# Altium project ToFAvoid.PrjPcb
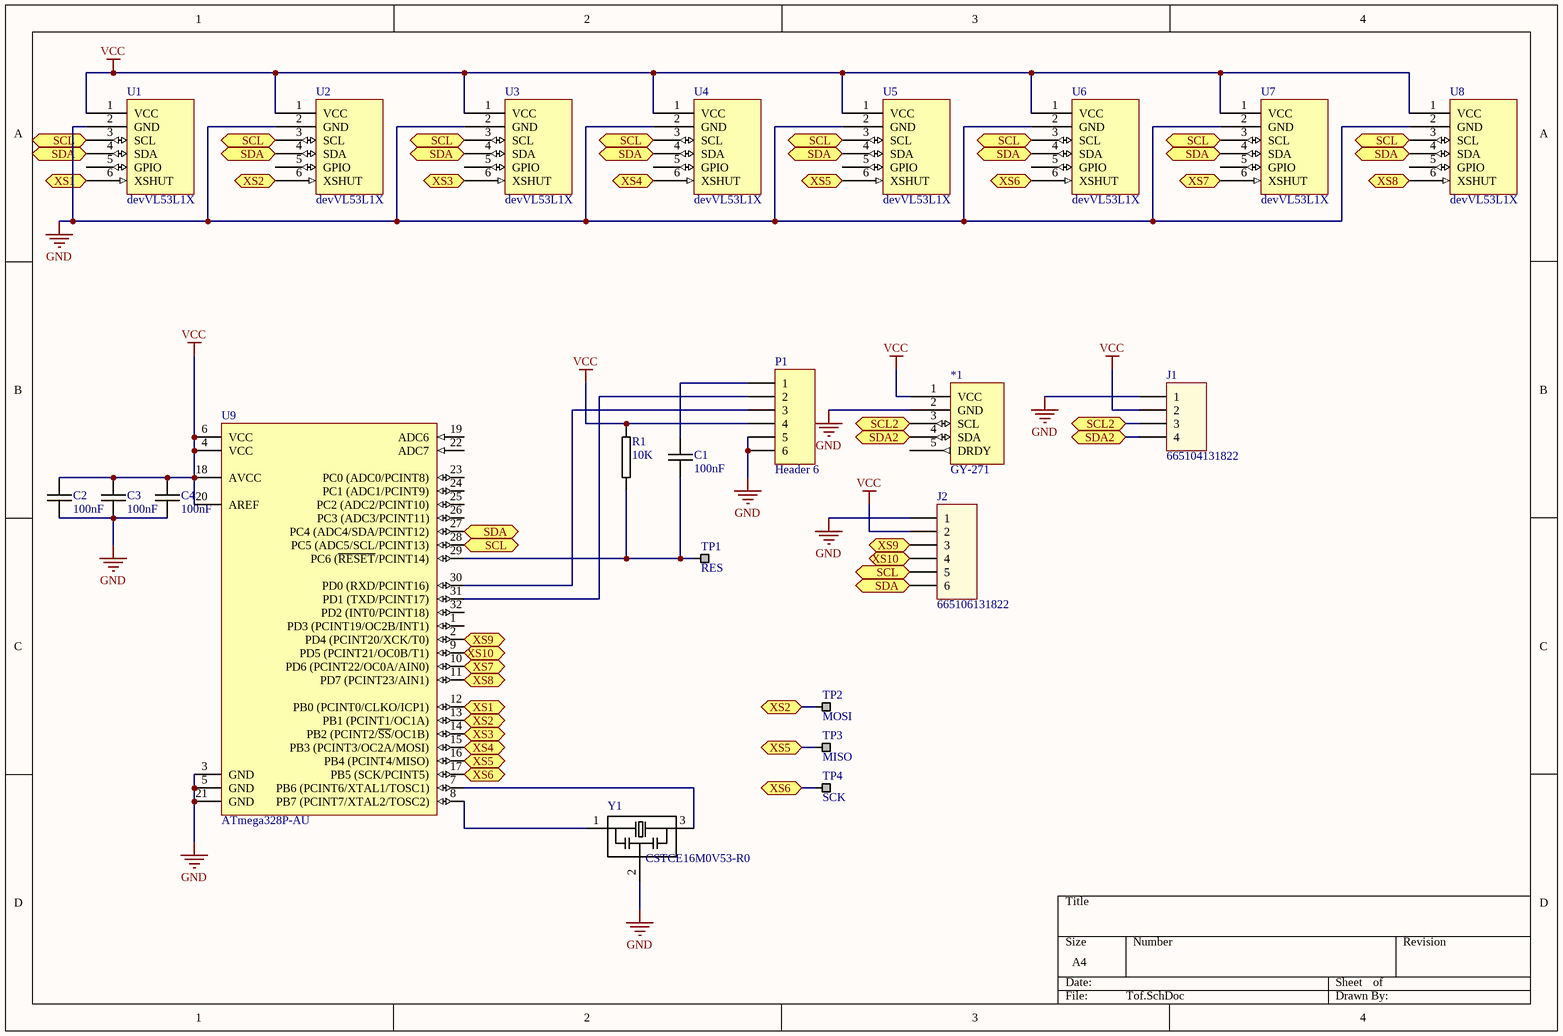
[diagram p0: Tof.SchDoc]
1 sheet, 23 parts. Net scope: flat (ports and power ports of the same name join across sheets).
Board file: ToF.PcbDoc

## Sheet Tof.SchDoc
size A4

### Parts
*1  GY-271  [GY-271]
C1  100nF  [0603C-GENERIC]
C2  100nF  [0603C-GENERIC]
C3  100nF  [0603C-GENERIC]
C4  100nF  [0603C-GENERIC]
J1  665104131822  [665104131822]
J2  665106131822  [665106131822]
P1  Header 6  [HDR1X6]
R1  10K  [0603R-10K]
TP1  RES  [TESTPIN]
TP2  MOSI  [TESTPIN]
TP3  MISO  [TESTPIN]
TP4  SCK  [TESTPIN]
U1  devVL53L1X  [TOF4]
U2  devVL53L1X  [TOF4]
U3  devVL53L1X  [TOF4]
U4  devVL53L1X  [TOF4]
U5  devVL53L1X  [TOF4]
U6  devVL53L1X  [TOF4]
U7  devVL53L1X  [TOF4]
U8  devVL53L1X  [TOF4]
U9  ATmega328P-AU  [32A_N]
Y1  CSTCE16M0V53-R0  [OSC_CSTCE16M0V53-R0]

### Ports
SCL, SCL2, SDA, SDA2, XS1, XS2, XS3, XS4, XS5, XS6, XS7, XS8, XS9, XS10

### Nets
GND: *1.2(GND) C2.2 C3.2 C4.2 J1.1 J2.1 P1.5 P1.6 U1.2(GND) U2.2(GND) U3.2(GND) U4.2(GND) U5.2(GND) U6.2(GND) U7.2(GND) U8.2(GND) U9.3(GND) U9.5(GND) U9.21(GND) Y1.2
VCC: *1.1(VCC) C2.1 C3.1 C4.1 J1.2 J2.2 P1.4 R1.2 U1.1(VCC) U2.1(VCC) U3.1(VCC) U4.1(VCC) U5.1(VCC) U6.1(VCC) U7.1(VCC) U8.1(VCC) U9.4(VCC) U9.6(VCC) U9.18(AVCC) U9.20(AREF)
Net*1_3: *1.3(SCL) J1.3 ; port SCL2
Net*1_4: *1.4(SDA) J1.4 ; port SDA2
NetC1_1: C1.1 P1.1
NetC1_2: C1.2 R1.1 TP1.1 U9.29(PC6_(~{RESET}/PCINT14))
NetJ2_3: J2.3 U9.2(PD4_(PCINT20/XCK/T0)) ; port XS9
NetJ2_4: J2.4 U9.9(PD5_(PCINT21/OC0B/T1)) ; port XS10
NetJ2_5: J2.5 U1.3(SCL) U2.3(SCL) U3.3(SCL) U4.3(SCL) U5.3(SCL) U6.3(SCL) U7.3(SCL) U8.3(SCL) U9.28(PC5_(ADC5/SCL/PCINT13)) ; port SCL
NetJ2_6: J2.6 U1.4(SDA) U2.4(SDA) U3.4(SDA) U4.4(SDA) U5.4(SDA) U6.4(SDA) U7.4(SDA) U8.4(SDA) U9.27(PC4_(ADC4/SDA/PCINT12)) ; port SDA
NetP1_2: P1.2 U9.31(PD1_(TXD/PCINT17))
NetP1_3: P1.3 U9.30(PD0_(RXD/PCINT16))
NetTP2_1: TP2.1 U2.6(XSHUT) U9.13(PB1_(PCINT1/OC1A)) ; port XS2
NetTP3_1: TP3.1 U5.6(XSHUT) U9.16(PB4_(PCINT4/MISO)) ; port XS5
NetTP4_1: TP4.1 U6.6(XSHUT) U9.17(PB5_(SCK/PCINT5)) ; port XS6
NetU1_6: U1.6(XSHUT) U9.12(PB0_(PCINT0/CLKO/ICP1)) ; port XS1
NetU3_6: U3.6(XSHUT) U9.14(PB2_(PCINT2/~{SS}/OC1B)) ; port XS3
NetU4_6: U4.6(XSHUT) U9.15(PB3_(PCINT3/OC2A/MOSI)) ; port XS4
NetU7_6: U7.6(XSHUT) U9.10(PD6_(PCINT22/OC0A/AIN0)) ; port XS7
NetU8_6: U8.6(XSHUT) U9.11(PD7_(PCINT23/AIN1)) ; port XS8
NetU9_7: U9.7(PB6_(PCINT6/XTAL1/TOSC1)) Y1.3
NetU9_8: U9.8(PB7_(PCINT7/XTAL2/TOSC2)) Y1.1

Not connected (* = marked no-connect by the designer): *1 5(DRDY); U1 5(GPIO); U2 5(GPIO); U3 5(GPIO); U4 5(GPIO); U5 5(GPIO); U6 5(GPIO); U7 5(GPIO); U8 5(GPIO); U9 1(PD3_(PCINT19/OC2B/INT1)) 19(ADC6) 22(ADC7) 23(PC0_(ADC0/PCINT8)) 24(PC1_(ADC1/PCINT9)) 25(PC2_(ADC2/PCINT10)) 26(PC3_(ADC3/PCINT11)) 32(PD2_(INT0/PCINT18))

### Library data of the parts
C1-C4 = 0603C-100NF-25V-X7R-TDK: CAPACITOR 0603 CERAMIC; Manufacturer Part Number: C1608X7R1E104K; Manufacturer: TDK Corporation; Reel: C12; Supplier 1: Digi-Key; Supplier Part Number 1: 445-1316-2-ND
J1 = 665104131822: WR-WTB 1.00 mm SMT Male Horizontal Shrouded, 4p; Pitch: 1 mm; Pin Number: 4; ComponentLink1Description: Manufacturer; ComponentLink1URL: http://www.we-online.de; ComponentLink2Description: Datasheet; ComponentLink2URL: http://katalog.we-online.de/em/datasheet/6651xx131822.pdf; Part Number: 665104131822; Published Date: June 2017; Publisher: Wurth Elektronik
J2 = 665106131822: WR-WTB 1.00 mm SMT Male Horizontal Shrouded, 6p; Pitch: 1 mm; Pin Number: 6; ComponentLink1Description: Manufacturer; ComponentLink1URL: http://www.we-online.de; ComponentLink2Description: Datasheet; ComponentLink2URL: http://katalog.we-online.de/em/datasheet/6651xx131822.pdf; Part Number: 665106131822; Published Date: June 2017; Publisher: Wurth Elektronik
P1 = Header 6: Header, 6-Pin; LatestRevisionDate: 17-Jul-2002; LatestRevisionNote: Re-released for DXP Platform.; Publisher: Altium Limited
R1 = 0603R-10K: GENERIC RESISTOR 0603; Manufacturer: Stackpole Electronics Inc; Manufacturer Part Number: RMCF 1/16 10K 1% R; Tolerance: ±1%; Power (Watts): 0.1W, 1/10W; Temperature Coefficient: ±100ppm/°C; Resistance In Ohms: 10.0K; Reel: R21; Category: Resistors; Supplier Part Number: RMCF1/1610KFRDKR-ND; Lead Style: Surface Mount (SMD - SMT); RoHS: RoHS Compliant; Packaging: Digi-Reel®; Case: 0603 (1608 metric); Composition: Thick Film; Supplier: Digi-Key; Supplier 1: Digi-Key; Supplier Part Number 1: RMCF0603FT10K0DKR-ND
TP1-TP4 = TESTPIN: TESTPIN SINGLE PIN HEADER; Manufacturer 1: Sharon Long Industries; Manufacturer Part Number 1: Cut-it-yourself; Reel: TH; Supplier 1: Sharon Long Industries; Supplier 1 Part number: Cut-It-Yourself
U1-U8 = devVL53L1X: ToF sensor
U9 = ATmega328P-AU: 8-bit AVR Microcontroller, 32KB Flash, 1KB EEPROM, 2KB SRAM, 32-pin TQFP, Industrial Grade (-40°C to 85°C); DatasheetVersion: revD, May-2011; PackageVersion: revC, Oct-2010; PackageReference: 32A; PackageDescription: 32-Lead, 7x7x1.0 mm Body, 0.8mm Lead Pitch, Thin Profile Plastic Quad Flat Package (TQFP); Code_JEDEC: MS-026-ABA; ComponentLink1Description: Manufacturer URL; ComponentLink1URL: http://www.atmel.com/; ComponentLink2Description: ATmega48A/48PA/88A/88PA/168A/168PA/328/328P Datasheet; ComponentLink2URL: http://www.atmel.com/dyn/resources/prod_documents/doc8271.pdf; ComponentLink3Description: ATmega48A/48PA/88A/88PA/168A/168PA/328/328P Summary; ComponentLink3URL: http://www.atmel.com/dyn/resources/prod_documents/8271S.pdf
Y1 = CSTCE16M0V53-R0: Ceramic Resonator 16MHz ??0.5% _Tol_ ??0.3% _Stability_ 15pF 40Ohm 3-Pin CSMD T/R; MF: Murata; SnapEDA_Link: https://www.snapeda.com/parts/CSTCE16M0V53-R0/Murata%20Electronics%20North%20America/view-part/?ref=snap; Availability: Unavailable; MP: CSTCE16M0V53-R0; Price: None; Package: SMD-3 Murata; Value: *